# EAGLE design AUDIO_PR_2020 (EAGLE 7.3.0)

## Sheet 1 of 2
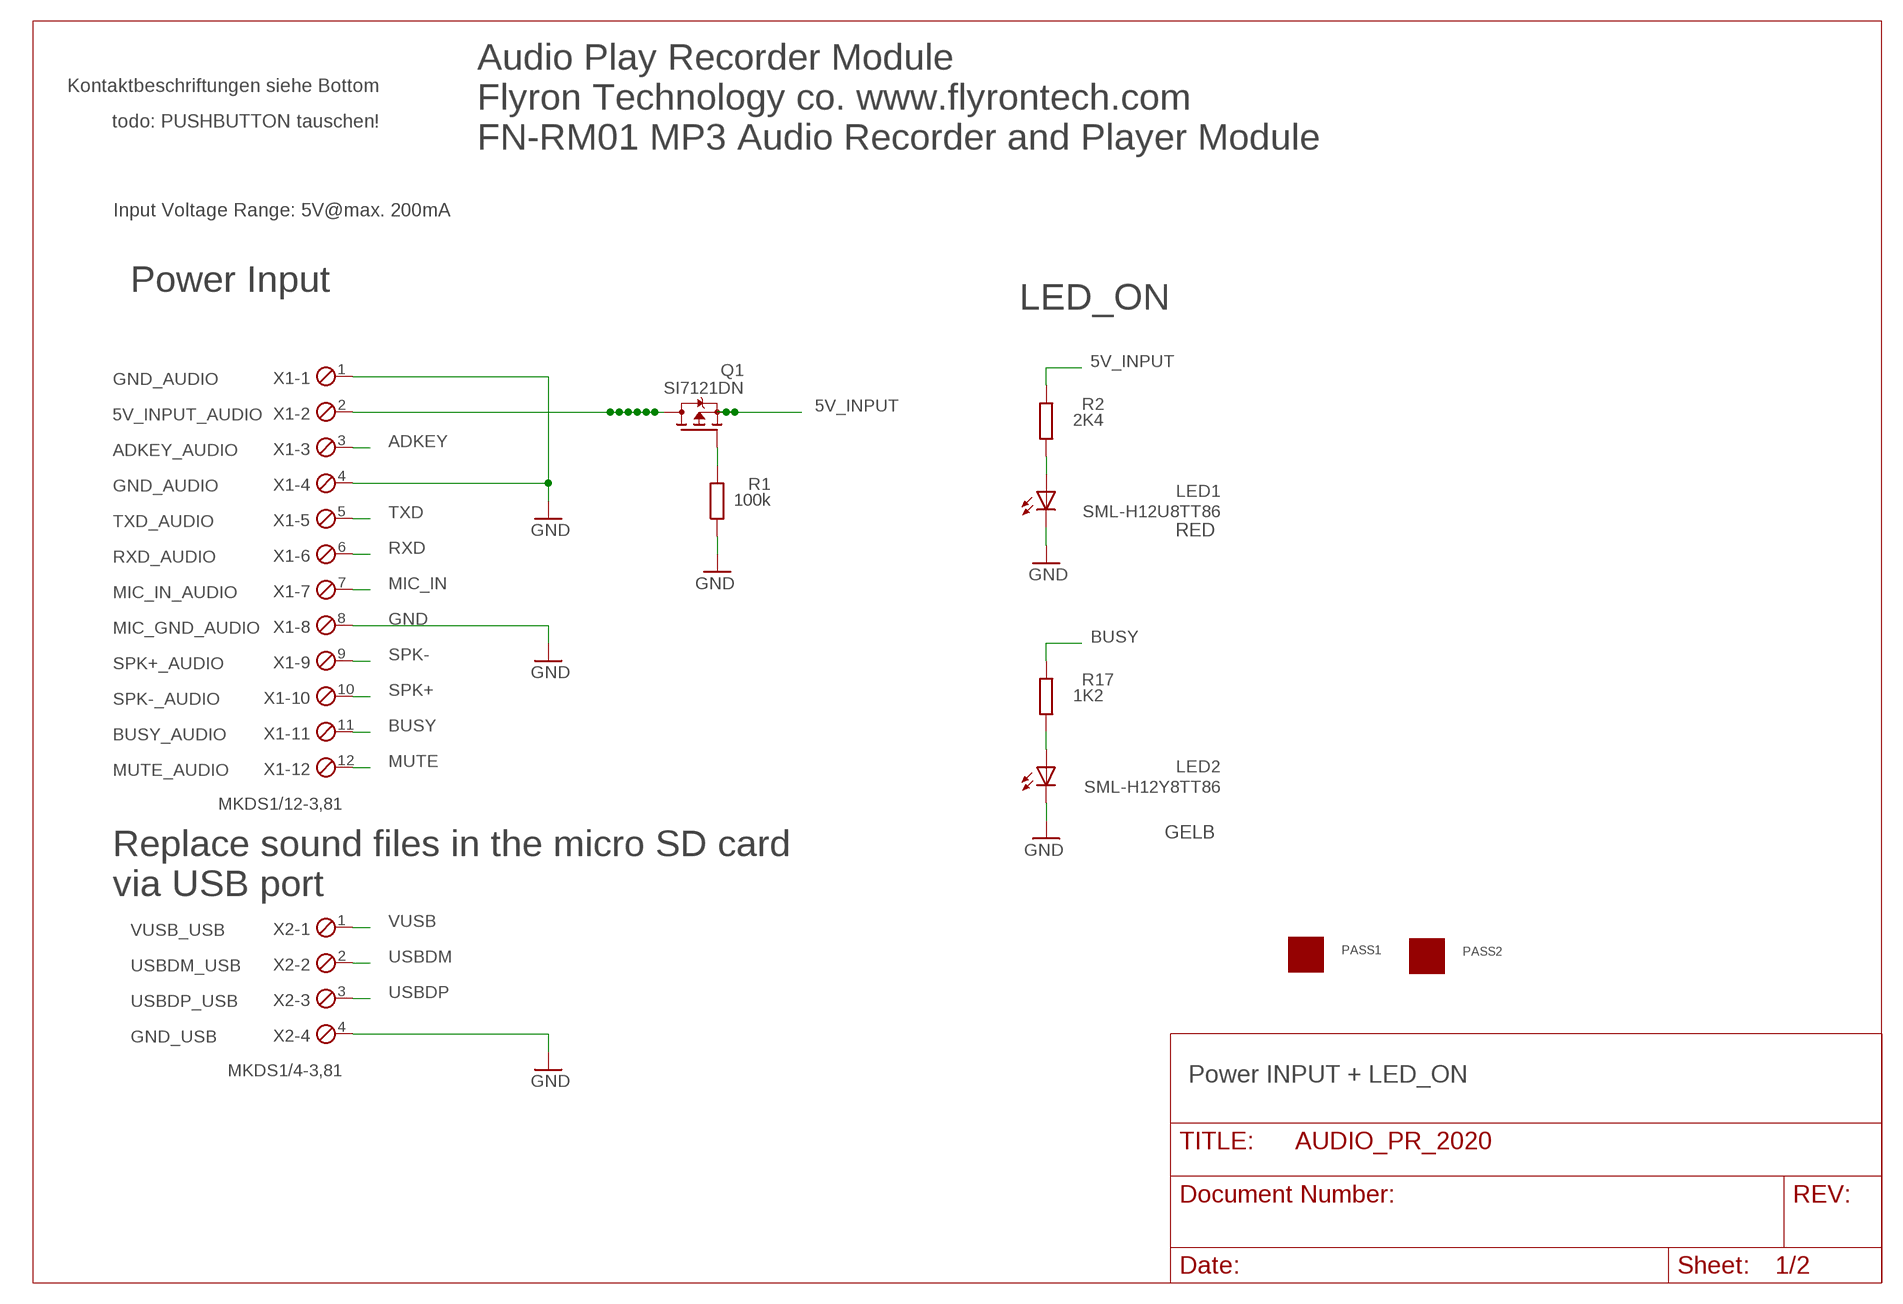
[diagram p0: schematic, sheet 1]

### Parts
LED1  SML-H12U8TT86  LEDCHIPLED_0805  [CHIPLED_0805]
LED2  SML-H12Y8TT86  LEDCHIPLED_0805  [CHIPLED_0805]
PASS1  ROUND_1MM1.5  [ROUND2_1.5MM]
PASS2  ROUND_1MM1.5  [ROUND2_1.5MM]
Q1  SI7121DN  TRANSISTOR-FET_SI7113DN  [TRANSISTOR-FET_1212-8S]
R1  100k  R-EU_R0805  [R0805]
R2  2K4  R-EU_R0805  [R0805]
R17  1K2  R-EU_R0805  [R0805]
X1  MKDS1/12-3,81  [12POL381]
X2  MKDS1/4-3,81  [4POL381]

### Nets
5V_INPUT: Q1.1(S) Q1.2(S) Q1.3(S) R2.1 ; also sheet 2
5V_INPUT_AUDIO: Q1.5(D) Q1.6(D) Q1.7(D) Q1.8(D) Q1.9(D) Q1.10(D) Q1.11(D) X1.2
ADKEY: X1.3 ; also sheet 2
BUSY: R17.1 X1.11 ; also sheet 2
GND: LED1.C LED2.C R1.1 X1.1 X1.4 X1.8 X2.4 ; also sheet 2
MIC_IN: X1.7 ; also sheet 2
MUTE: X1.12 ; also sheet 2
N$4: LED2.A R17.2
N$20: Q1.4(G) R1.2
N$29: LED1.A R2.2
RXD: X1.6 ; also sheet 2
SPK+: X1.10 ; also sheet 2
SPK-: X1.9 ; also sheet 2
TXD: X1.5 ; also sheet 2
USBDM: X2.2 ; also sheet 2
USBDP: X2.3 ; also sheet 2
VUSB: X2.1 ; also sheet 2

### Notes on the sheet
- Kontaktbeschriftungen siehe Bottom
- todo: PUSHBUTTON tauschen!
- Audio Play Recorder Module
  Flyron Technology co. www.flyrontech.com
  FN-RM01 MP3 Audio Recorder and Player Module
- Input Voltage Range: 5V@max. 200mA
- Power Input
- LED_ON
- GND_AUDIO
- 5V_INPUT_AUDIO
- ADKEY_AUDIO
- GND_AUDIO
- TXD_AUDIO
- RED
- RXD_AUDIO
- MIC_IN_AUDIO
- MIC_GND_AUDIO
- SPK+_AUDIO
- SPK-_AUDIO
- BUSY_AUDIO
- MUTE_AUDIO
- GELB
- Replace sound files in the micro SD card
  via USB port
- VUSB_USB
- USBDM_USB
- USBDP_USB
- GND_USB
- Power INPUT + LED_ON

## Sheet 2 of 2
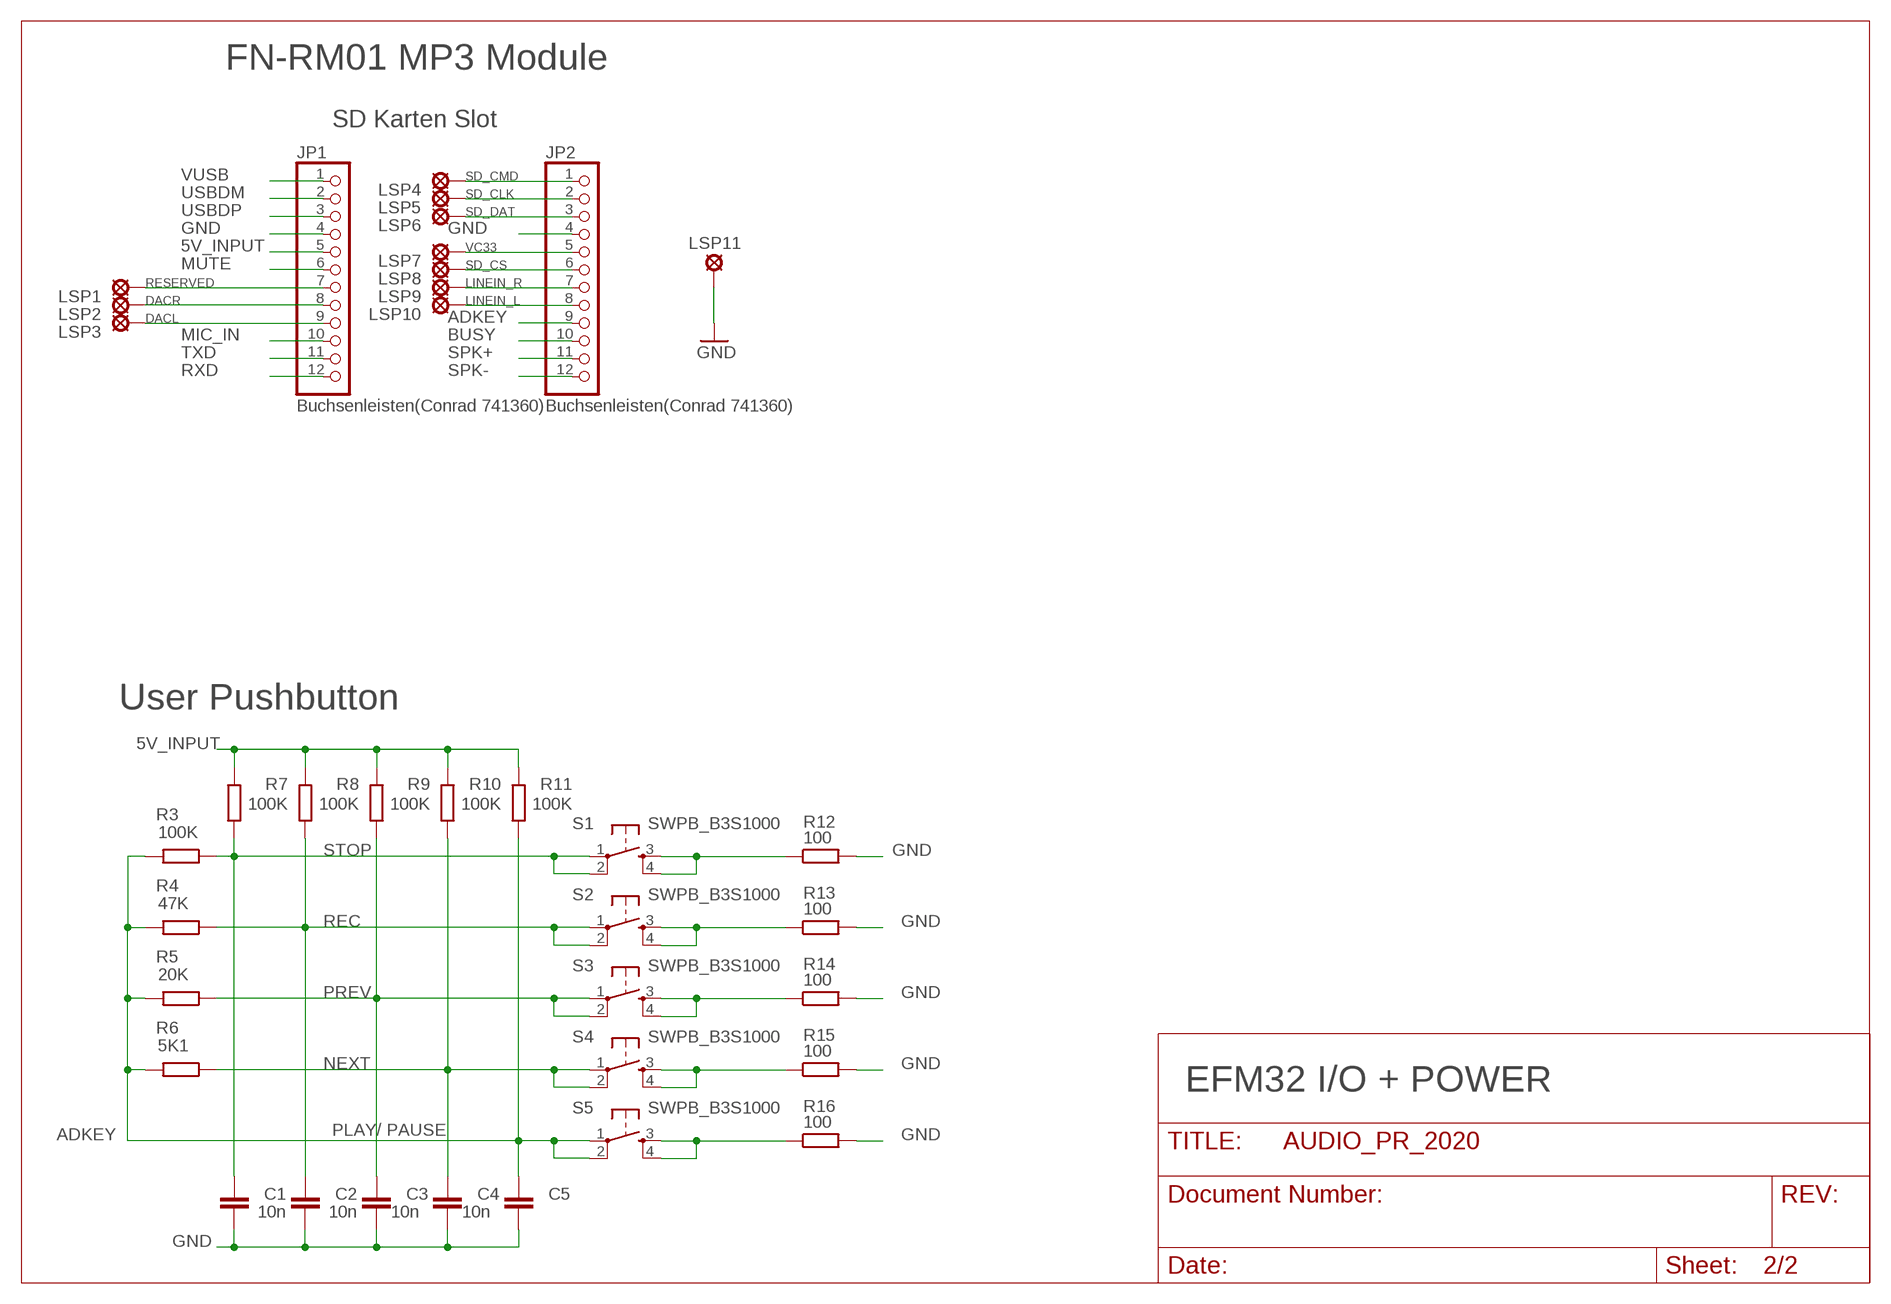
[diagram p1: schematic, sheet 2]

### Parts
C1  10n  C-EUC0603  [C0603]
C2  10n  C-EUC0603  [C0603]
C3  10n  C-EUC0603  [C0603]
C4  10n  C-EUC0603  [C0603]
C5  10n  C-EUC0603  [C0603]
JP1  Buchsenleisten(Conrad 741360)  PINHD-1X12  [1X12]
JP2  Buchsenleisten(Conrad 741360)  PINHD-1X12  [1X12]
LSP1  LSP10  [LSP10]
LSP2  LSP10  [LSP10]
LSP3  LSP10  [LSP10]
LSP4  LSP10  [LSP10]
LSP5  LSP10  [LSP10]
LSP6  LSP10  [LSP10]
LSP7  LSP10  [LSP10]
LSP8  LSP10  [LSP10]
LSP9  LSP10  [LSP10]
LSP10  LSP10  [LSP10]
LSP11  LSP10  [LSP10]
R3  100K  R-EU_R0805  [R0805]
R4  47K  R-EU_R0805  [R0805]
R5  20K  R-EU_R0805  [R0805]
R6  5K1  R-EU_R0805  [R0805]
R7  100K  R-EU_R0805  [R0805]
R8  100K  R-EU_R0805  [R0805]
R9  100K  R-EU_R0805  [R0805]
R10  100K  R-EU_R0805  [R0805]
R11  100K  R-EU_R0805  [R0805]
R12  100  R-EU_R0805  [R0805]
R13  100  R-EU_R0805  [R0805]
R14  100  R-EU_R0805  [R0805]
R15  100  R-EU_R0805  [R0805]
R16  100  R-EU_R0805  [R0805]
S1  SWPB_B3S1000  DTSM-6  [DTSM-6]
S2  SWPB_B3S1000  DTSM-6  [DTSM-6]
S3  SWPB_B3S1000  DTSM-6  [DTSM-6]
S4  SWPB_B3S1000  DTSM-6  [DTSM-6]
S5  SWPB_B3S1000  DTSM-6  [DTSM-6]

### Nets
5V_INPUT: JP1.5 R7.2 R8.2 R9.2 R10.2 R11.2 ; also sheet 1
ADKEY: C5.2 JP2.9 R3.2 R4.2 R5.2 R6.2 R11.1 S5.1 S5.2 ; also sheet 1
BUSY: JP2.10 ; also sheet 1
DACL: JP1.9 LSP3.MP
DACR: JP1.8 LSP2.MP
GND: C1.1 C2.1 C3.1 C4.1 C5.1 JP1.4 JP2.4 LSP11.MP R12.2 R13.2 R14.2 R15.2 R16.2 ; also sheet 1
LINEIN_L: JP2.8 LSP10.MP
LINEIN_R: JP2.7 LSP9.MP
MIC_IN: JP1.10 ; also sheet 1
MUTE: JP1.6 ; also sheet 1
N$2: R14.1 S3.3 S3.4
N$5: R15.1 S4.3 S4.4
N$6: R16.1 S5.3 S5.4
N$23: R12.1 S1.3 S1.4
N$24: R13.1 S2.3 S2.4
NEXT: C4.2 R6.1 R10.1 S4.1 S4.2
PREV: C3.2 R5.1 R9.1 S3.1 S3.2
REC: C2.2 R4.1 R8.1 S2.1 S2.2
RESERVED: JP1.7 LSP1.MP
RXD: JP1.12 ; also sheet 1
SD_CLK: JP2.2 LSP5.MP
SD_CMD: JP2.1 LSP4.MP
SD_CS: JP2.6 LSP8.MP
SD_DAT: JP2.3 LSP6.MP
SPK+: JP2.11 ; also sheet 1
SPK-: JP2.12 ; also sheet 1
STOP: C1.2 R3.1 R7.1 S1.1 S1.2
TXD: JP1.11 ; also sheet 1
USBDM: JP1.2 ; also sheet 1
USBDP: JP1.3 ; also sheet 1
VC33: JP2.5 LSP7.MP
VUSB: JP1.1 ; also sheet 1

### Notes on the sheet
- FN-RM01 MP3 Module
- SD Karten Slot
- User Pushbutton
- EFM32 I/O + POWER
- PLAY/ PAUSE

## Library data of the parts
C1-C5 = resistor:C-EU: CAPACITOR, European symbol
JP1 JP2 = pinhead:PINHD-1X12: PIN HEADER
LED1 LED2 = led:LED: LED OSRAM: - CHIPLED LG R971, LG N971, LY N971, LG Q971, LY Q971, LO R971, LY R971 LH N974, LH R974 LS Q976, LO Q976, LY Q976 LO Q996 - Hyper CHIPLED LW Q18S LB Q993, LB Q99A, LB R99A - SideLED LS A670, LO A670, LY A670, LG A670, LP A670 LB A673, LV A673, LT A673, LW A673 LH A674 LY A675 LS A676, LA A676, LO A676, LY A676, LW A676 LS A679, LY A679, LG A679 - Hyper Micro SIDELED® LS Y876, LA Y876, LO Y876, LY Y876 LT Y87S - SmartLED LW L88C, LW L88S LB L89C, LB L89S, LG L890 LS L89K, LO L89K, LY L89K LS L896, LA L896, LO L896, LY L896 - TOPLED LS T670, LO T670, LY T670, LG T670, LP T670 LSG T670, LSP T670, LSY T670, LOP T670, LYG T670 LG T671, LOG T671, LSG T671 LB T673, LV T673, LT T673, LW T673 LH T674 LS T676, LA T676, LO T676, LY T676, LB T676, LH T676, LSB T676, LW T676 LB T67C, LV T67C, LT T67C, LS T67K, LO T67K, LY T67K, LW E67C LS E67B, LA E67B, LO E67B, LY E67B, LB E67C, LV E67C, LT E67C LW T67C LS T679, LY T679, LG T679 LS T770, LO T770, LY T770, LG T770, LP T770 LB T773, LV T773, LT T773, LW T773 LH T774 LS E675, LA E675, LY E675, LS T675 LS T776, LA T776, LO T776, LY T776, LB T776 LHGB T686 LT T68C, LB T68C - Hyper Mini TOPLED® LB M676 - Mini TOPLED Santana® LG M470 LS M47K, LO M47K, LY M47K Source: http://www.osram.convergy.de LUXEON: - LUMILED® LXK2-PW12-R00, LXK2-PW12-S00, LXK2-PW14-U00, LXK2-PW14-V00 LXK2-PM12-R00, LXK2-PM12-S00, LXK2-PM14-U00 LXK2-PE12-Q00, LXK2-PE12-R00, LXK2-PE12-S00, LXK2-PE14-T00, LXK2-PE14-U00 LXK2-PB12-K00, LXK2-PB12-L00, LXK2-PB12-M00, LXK2-PB14-N00, LXK2-PB14-P00, LXK2-PB14-Q00 LXK2-PR12-L00, LXK2-PR12-M00, LXK2-PR14-Q00, LXK2-PR14-R00 LXK2-PD12-Q00, LXK2-PD12-R00, LXK2-PD12-S00 LXK2-PH12-R00, LXK2-PH12-S00 LXK2-PL12-P00, LXK2-PL12-Q00, LXK2-PL12-R00 Source: www.luxeon.com KINGBRIGHT: KA-3528ASYC Source: www.kingbright.com
LSP1-LSP11 = solpad:LSP10: SOLDER PAD drill 1.0 mm, distributor Buerklin, 12H555
PASS1 PASS2 = Passermarks:ROUND_1MM
Q1 = dcdc_BB3_V0:TRANSISTOR-FET_SI7113DN
R1-R17 = resistor:R-EU_: RESISTOR, European symbol
S1-S5 = switch-tact:DTSM-6
X1 = con-phoenix-381:MKDS1/12-3,81: MKDS 1/12-3,81 - Order No. 1727117 Pitch: 3,81mm Number of terminals: 12 Rated Voltage: 160V Maximum load current/ cross section: 12A/1.5mm2-AWG16 Housing Interlocking: none Color: Green
X2 = con-phoenix-381:MKDS1/4-3,81: MKDS 1/4-3,81 - Order No. 1727036 Pitch: 3,81mm Number of terminals: 4 Rated Voltage: 160V Maximum load current/ cross section: 12A/1.5mm2-AWG16 Housing Interlocking: none Color: Green

## Net classes
1 GND: width 0.2 mm
2 VCC: width 0.25 mm

## Board
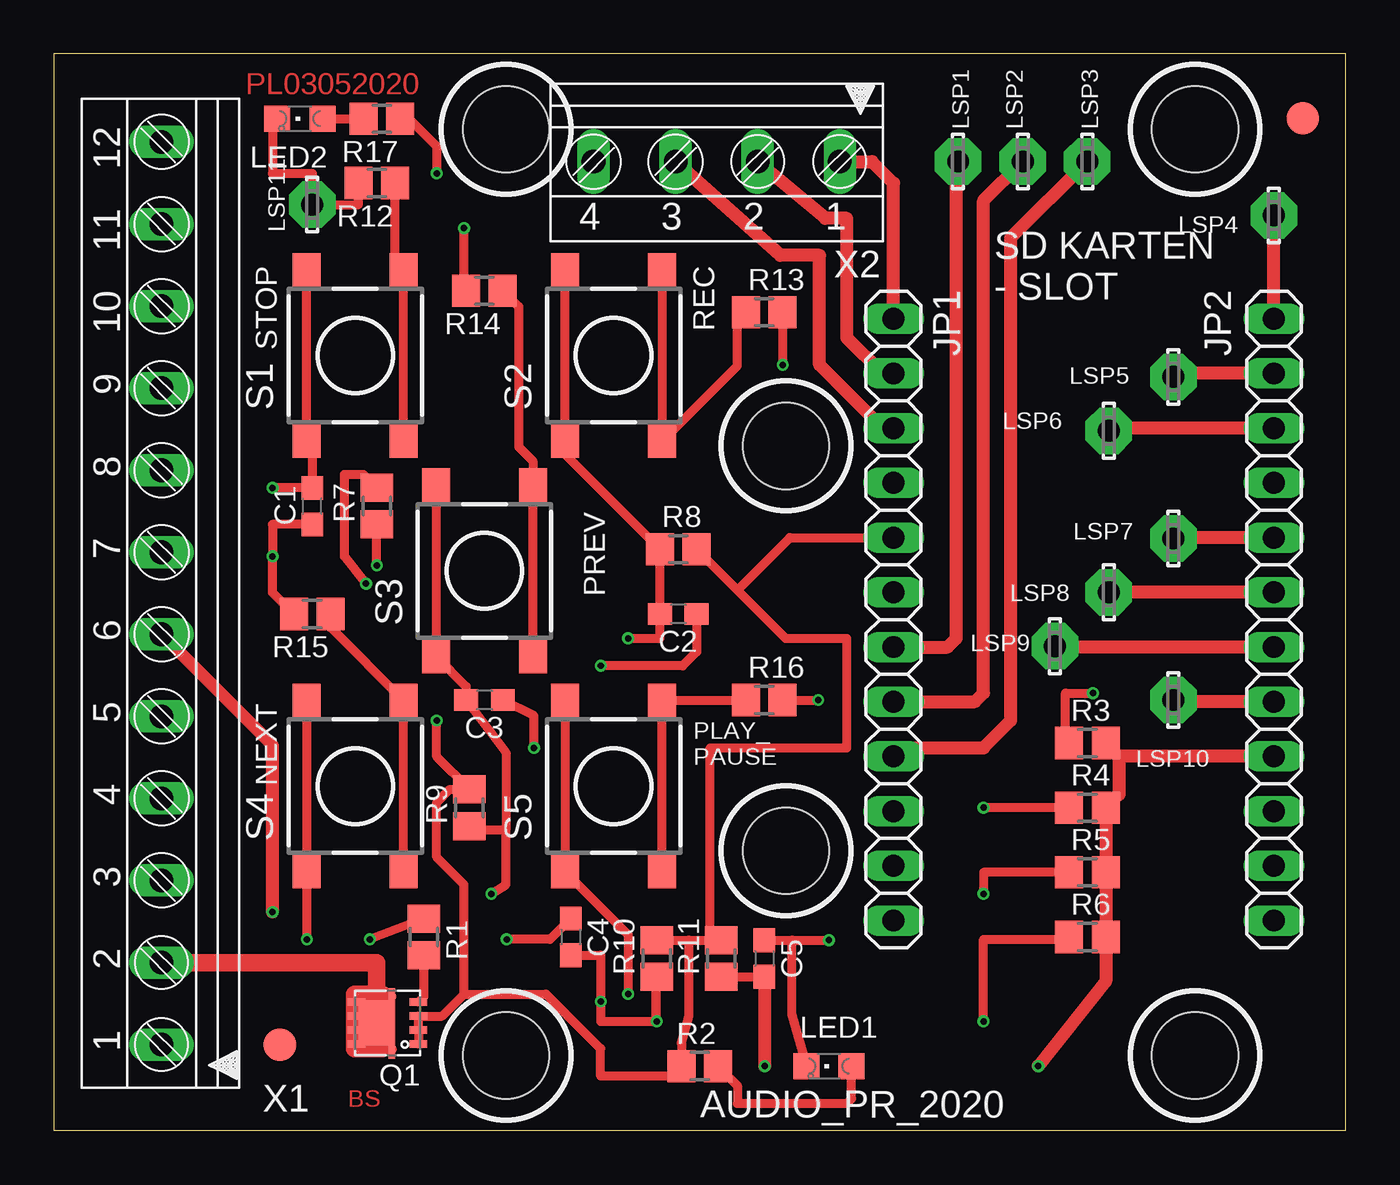
[diagram p2: board, top side]
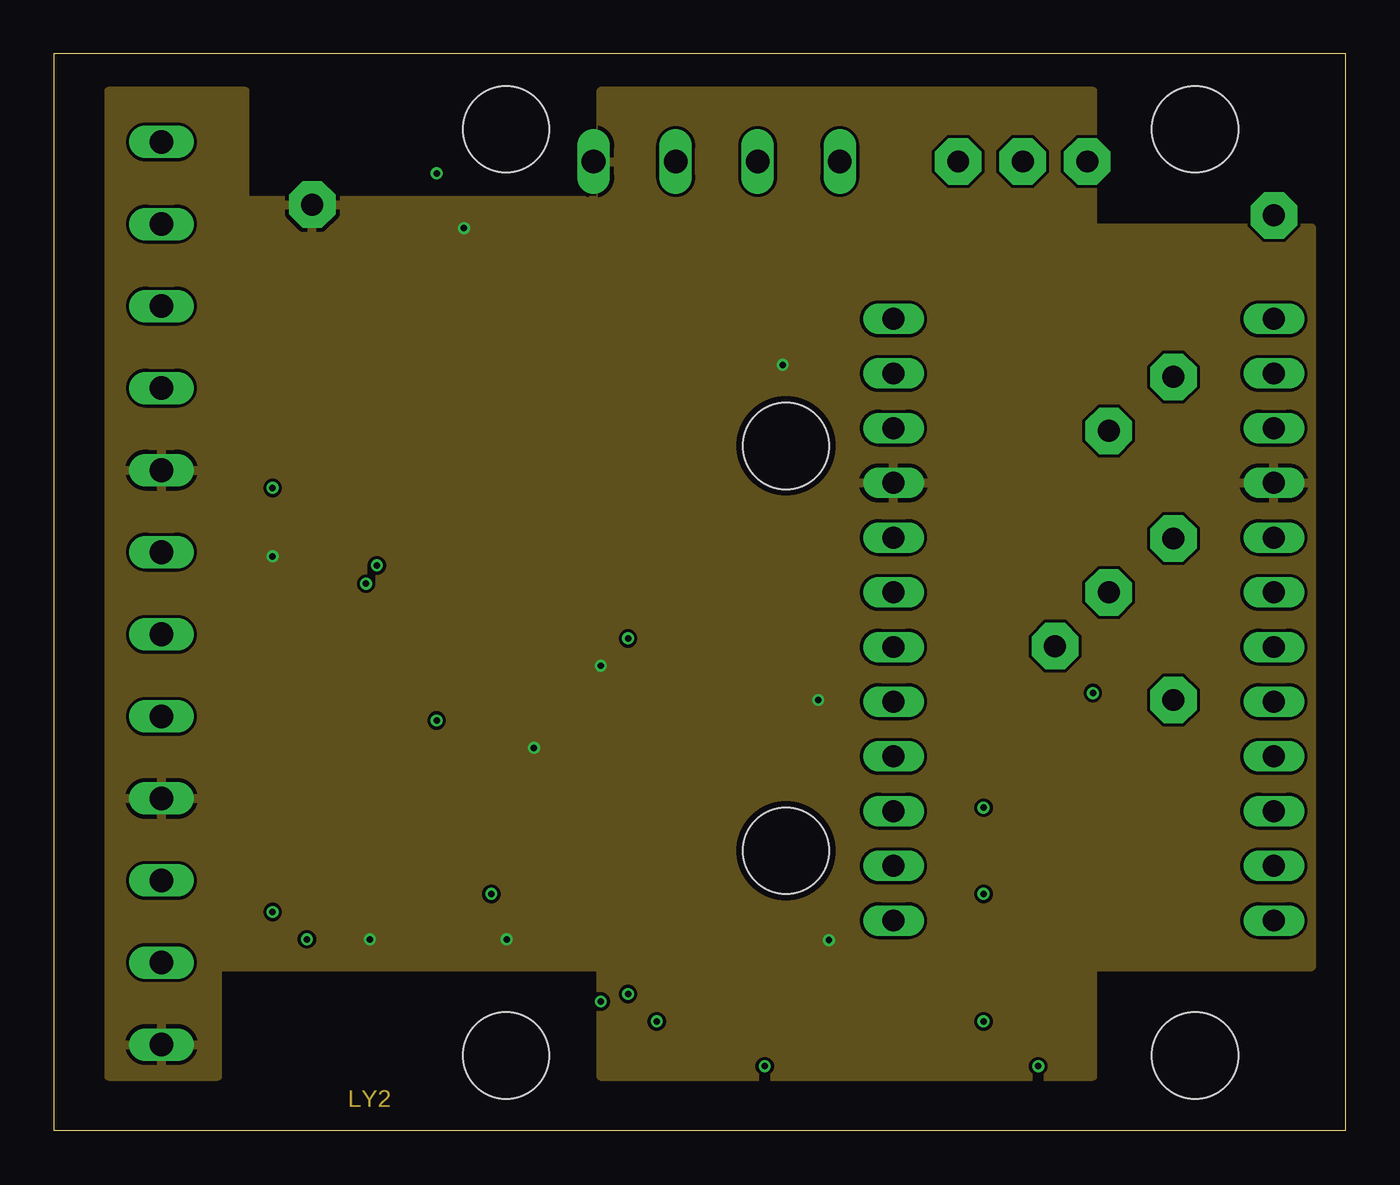
[diagram p3: board, inner layer Route2]
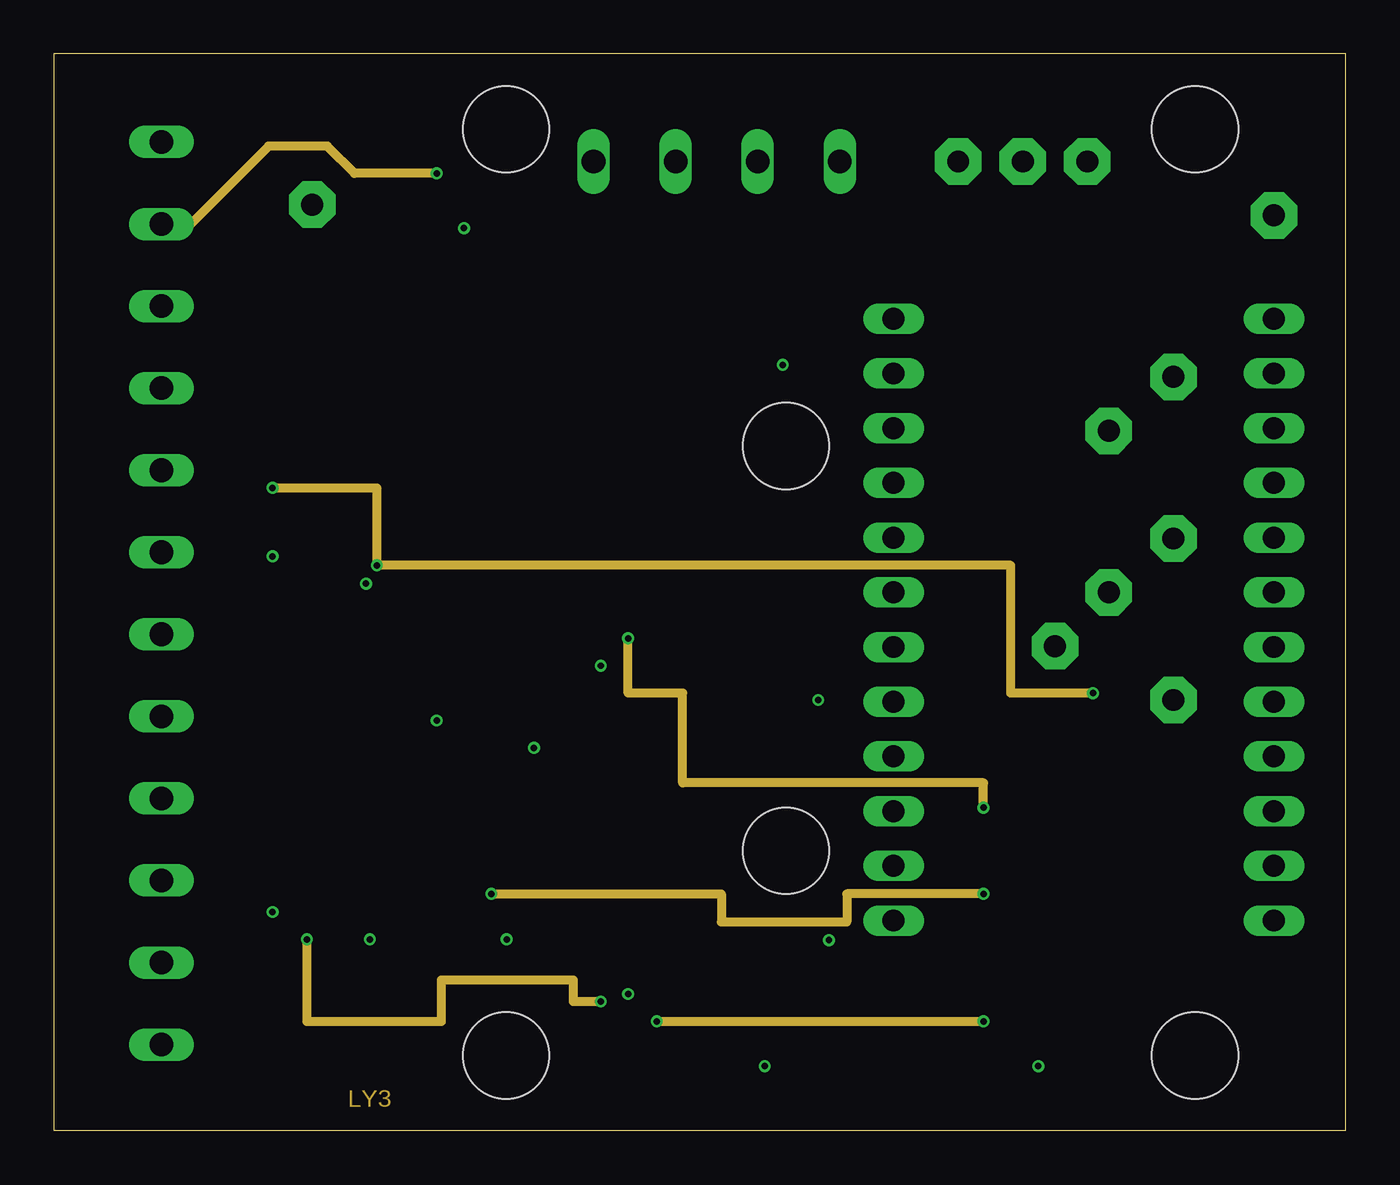
[diagram p4: board, inner layer Route3]
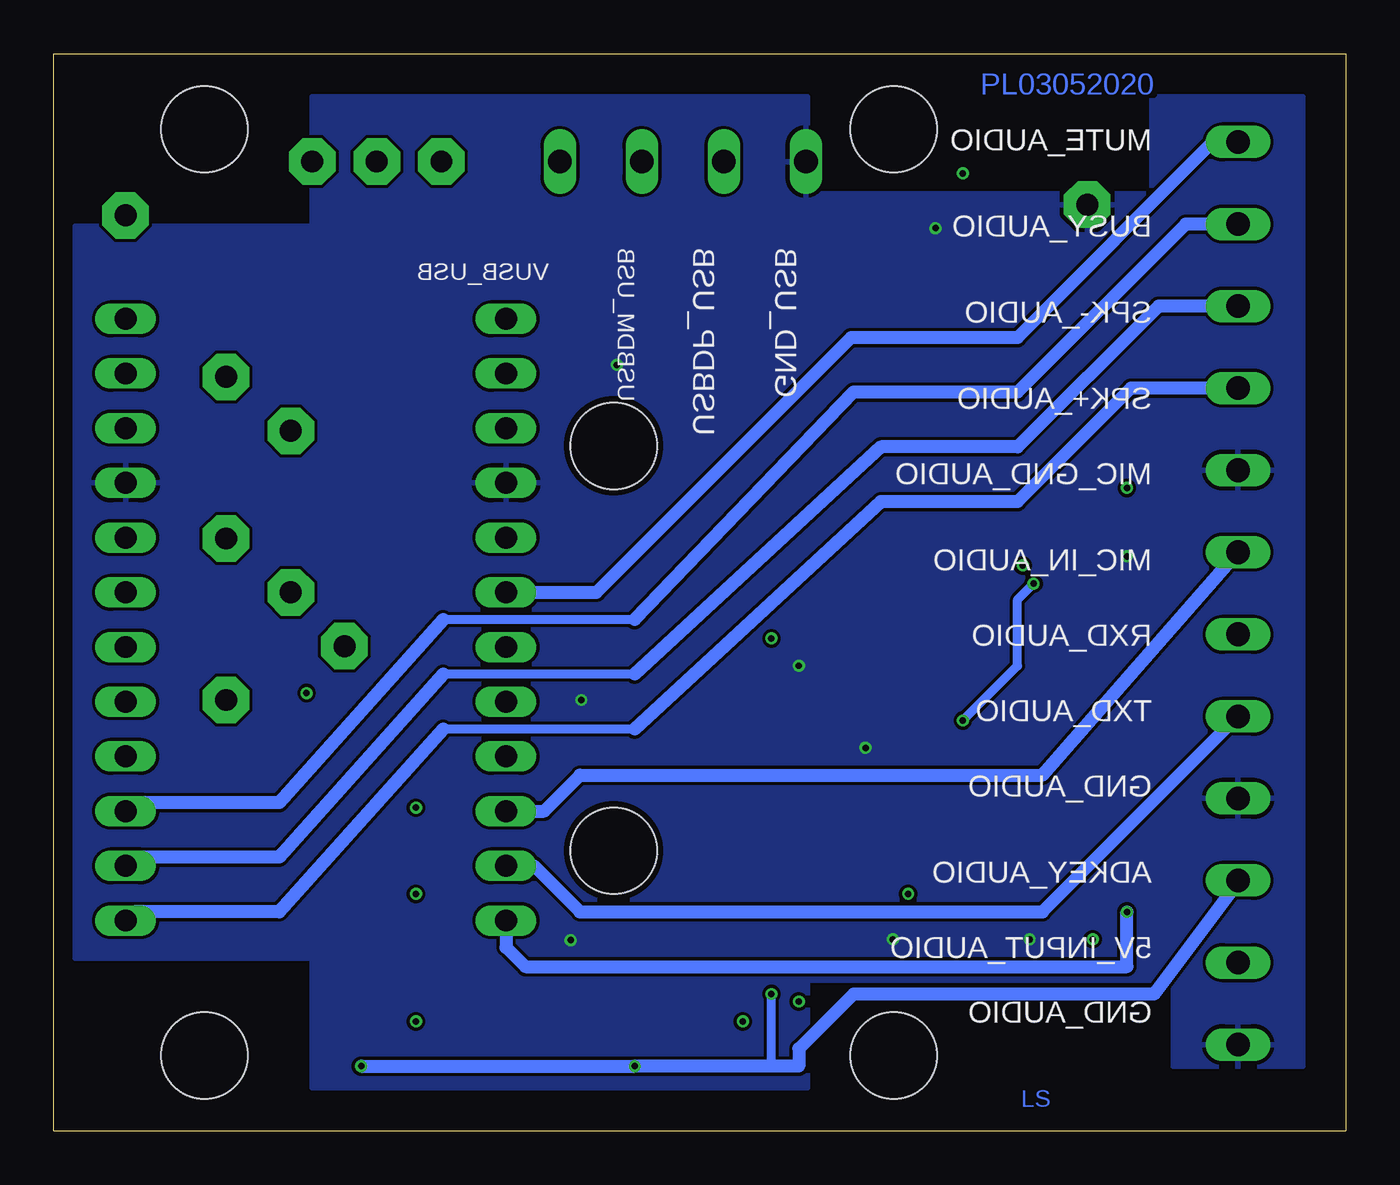
[diagram p5: board, bottom side, seen from below]

Size 60 x 50 mm. Coordinates in mm from the lower left corner, seen from the top.
Outline: 0,50 0,0 60,0 60,50 0,50
Copper layers (1+2*3+16): Top 0.035mm / dielectric 0.2mm / Route2 0.035mm / dielectric 1mm / Route3 0.035mm / dielectric 0.2mm / Bottom 0.035mm
Design rules "default *": minimum track width 0.125mm, minimum drill 0.2mm, track to track 0.15mm, track to pad 0.15mm, pad to pad 0.15mm, via to via 0.15mm, smd to smd 0mil, copper to edge 0.3mm, drill to drill 0.2mm, minimum pad ring 0.2mm, minimum via ring 0.125mm, stop-mask expansion 0.075mm, vias tented up to drill 0mil, thermal gap 0.2mm
Holes 4 mm at 21,46.5 53,3.5 21,3.5 53,46.5 34,13 34,31.8

### Footprints (pad centres in the part's own frame; a part is rotated, then mirrored left to right if it is on the bottom)
C0603 = smd 1.1 x 1: 1 -0.85,0; 2 0.85,0
1X12 = drill 1.016 long: 1 -13.97,0; 2 -11.43,0; 3 -8.89,0; 4 -6.35,0; 5 -3.81,0; 6 -1.27,0; 7 1.27,0; 8 3.81,0; 9 6.35,0; 10 8.89,0; 11 11.43,0; 12 13.97,0
CHIPLED_0805 = smd 1.2 x 1.2: A 0,-1.05; C 0,1.05
LSP10 = drill 1.016 pad 2.159 octagon: MP 0,0
ROUND2_1.5MM = smd 1.5 x 1.5: FID 0,0
TRANSISTOR-FET_1212-8S = smd 0.8 x 0.34: 1 -1.435,0.97; 2 -1.435,0.325; 3 -1.435,-0.325; 4 -1.435,-0.975; 5 1.435,-0.975; 6 1.435,-0.325; 7 1.435,0.325; 8 1.435,0.975 | smd 0.3 x 0.8: 9 -0.2,-1.225; 10 -0.2,1.25 | smd 1.7 x 2.1: 11 0.5,-0.015
R0805 = smd 1.3 x 1.5: 1 -0.85,0; 2 0.85,0
DTSM-6 = smd 1.55 x 1.3: 1 -3.975,2.25; 2 3.975,2.25; 3 -3.975,-2.25; 4 3.975,-2.25
12POL381 = drill 1.1 long: 1 0,0; 2 3.81,0; 3 7.62,0; 4 11.43,0; 5 15.24,0; 6 19.05,0; 7 22.86,0; 8 26.67,0; 9 30.48,0; 10 34.29,0; 11 38.1,0; 12 41.91,0
4POL381 = drill 1.1 long: 1 0,0; 2 3.81,0; 3 7.62,0; 4 11.43,0

### Placement (x,y rotation side)
C1  12,29 90 top
C2  29,24 180 top
C3  20,20 180 top
C4  24,9 270 top
C5  33,8 270 top
JP1  39,23.73 270 top
JP2  56.67,23.73 270 top
LED1  36,3 90 top
LED2  11.43,46.99 90 top
LSP1  42,45 90 top
LSP2  45,45 90 top
LSP3  48,45 90 top
LSP4  56.67,42.5 90 top
LSP5  52,35 90 top
LSP6  49,32.5 90 top
LSP7  52,27.5 90 top
LSP8  49,25 90 top
LSP9  46.5,22.5 90 top
LSP10  52,20 90 top
LSP11  12,43 90 top
PASS1  10.5,4 0 top
PASS2  58,47 0 top
Q1  15.5,5 180 top
R1  17.19,9 270 top
R2  30,3 0 top
R3  48,18 0 top
R4  48,15 0 top
R5  48,12 0 top
R6  48,9 0 top
R7  15,29 90 top
R8  29,27 0 top
R9  19.3,15 90 top
R10  28,8 90 top
R11  31,8 90 top
R12  15,44 180 top
R13  33,38 0 top
R14  20,39 180 top
R15  12,24 180 top
R16  33,20 0 top
R17  15.24,46.99 180 top
S1  14,36 90 top
S2  26,36 90 top
S3  20,26 90 top
S4  14,16 90 top
S5  26,16 90 top
X1  5,4 90 top
X2  36.5,45 180 top

### Tracks (layer width: path | path; a pad name or v marks a point on that pad's centre or on a via)
5V_INPUT  (via drill 0.3)
  Top 0.406: Q1.1 Q1.2 Q1.3 18.02,5.33 19.05,6.35 | 29.5,8.85 29.5,5.33 29.15,4.05 R2.1 29.07,2.54 25.4,2.54 25.4,3.81 22.86,6.35 19.05,6.35 | R10.2 29.5,8.85 | 29.5,8.85 R11.2 30.48,9.37 30.48,17.78 36.83,17.78 36.83,22.86 33.99,22.86 31.75,25.1 | 19.05,6.35 19.05,11.43 17.78,12.7 17.78,15.24 18.39,15.85 R9.2 17.78,17.37 v17.78,19.05 | R7.2 14.37,30.48 13.5,30.48 13.5,26.67 v14.5,25.4 | R8.2 31.75,25.1 | 31.75,25.1 34.19,27.54 JP1.5
  Bottom 0.406: v17.78,19.05 15.24,21.59 15.24,24.66 v14.5,25.4
5V_INPUT_AUDIO
  Top 0.406: Q1.9 15,6.22 | 15.24,3.81 15.7,3.81 Q1.10
  Top 0.813: X1.2 15,7.81 Q1.11 | Q1.5 Q1.6 | Q1.6 Q1.7 | Q1.7 Q1.8 | Q1.6 15,5.33 Q1.11 | Q1.11 15.24,5.01 15.24,6.35 14.06,6.35 | 13.97,5.08 15.24,5.08 15.24,3.81 13.97,3.81 13.97,4.67 | 14.06,6.35 13.97,6.35 13.97,5.08 | 14.06,6.35 Q1.7 | Q1.7 13.97,4.67 | 13.97,4.67 13.97,5.08 | 15,6.22 Q1.11
ADKEY  (via drill 0.3)
  Top 0.406: S5.2 S5.1 26.67,9.11 v26.67,6.35 | R11.1 C5.2
  Top 0.61: JP2.9 49.47,17.38 | 49.47,17.38 R3.2 | 49.47,17.38 49.47,15.62 R4.2 R5.2 R6.2 48.85,6.94 v45.72,3 | v33.02,3 33.02,7.13 C5.2
  Bottom 0.406: 25.4,3 26.67,3 v26.67,6.35
  Bottom 0.61: v45.72,3 v33.02,3 25.4,3 25.4,3.81 22.86,6.35 8.89,6.35 5,11.51 X1.3
BUSY  (via drill 0.3)
  Top 0.406: R17.1 16.51,46.99 17.78,45.72 v17.78,44.45
  Route3 0.406: v17.78,44.45 13.97,44.45 12.7,45.72 9.97,45.72 6.35,42.1 X1.11
  Bottom 0.406: 33.02,23.73 41.91,23.73
  Bottom 0.61: X1.11 7.43,42.1 15.24,34.29 22.86,34.29 33.02,23.73 | 41.91,23.73 49.53,15.24 56.27,15.24 JP2.10
DACL
  Top 0.61: JP1.9 39,17.41 39.37,17.78 43.18,17.78 44.45,19.05 44.45,41.45 LSP3.MP
DACR
  Top 0.61: JP1.8 42.78,19.92 43.18,20.32 43.18,43.18 LSP2.MP
GND  (via drill 0.3)
  Top 0.406: R15.2 10.16,24.99 v10.16,26.67 10.16,28.15 C1.1 | R12.2 14.15,43 LSP11.MP 12,44.45 10.16,44.45 10.16,46.99 LED2.C | R14.2 19.05,39 v19.05,41.91 | R13.2 v33.85,35.56 33.85,35.5 | v22.3,17.78 22.3,19.26 C3.1 | C5.1 34.29,8.85 | 34.29,8.85 v36,8.85 | LED1.C 34.29,5.34 34.29,8.85 | R16.2 v35.5,20 | C2.1 29.85,22.23 29.21,21.59 v25.4,21.59 | R1.1 v14.68,8.89 | C4.1 23.04,8.89 v21.03,8.89
  pour Bottom: 2,48 9,48 9,43.5 25,43.5 25,48 48,48 48,42 59,42 59,8 48,8 48,2 25,2 25,7 8,7 8,3 2,3
  pour Route2: 2.54,48.26 2.54,2.54 7.62,2.54 7.62,7.62 25.4,7.62 25.4,2.54 48.26,2.54 48.26,7.62 58.42,7.62 58.42,41.91 48.26,41.91 48.26,48.26 25.4,48.26 25.4,43.18 8.89,43.18 8.89,48.26
LINEIN_L
  Top 0.61: JP2.8 52.08,19.92 LSP10.MP
LINEIN_R
  Top 0.61: JP2.7 47.54,22.46 LSP9.MP
MIC_IN
  Bottom 0.61: JP1.10 37.23,14.84 35.56,16.51 14.08,16.51 X1.7
MUTE
  Bottom 0.61: JP1.6 34.8,25 22.97,36.83 15.24,36.83 6.16,45.91 X1.12
N$2
  Top 0.406: R14.1 21.59,38.26 21.59,31.75 22.25,31.09 S3.4 S3.3
N$4
  Top 0.406: LED2.A R17.2
N$5
  Top 0.406: S4.3 S4.4 12.85,23.38 R15.1
N$6
  Top 0.406: S5.3 S5.4 32.12,19.98 R16.1
N$20
  Top 0.406: Q1.4 17.19,6.23 R1.2
N$23
  Top 0.406: S1.3 S1.4 15.85,40.38 R12.1
N$24
  Top 0.406: S2.4 S2.3 31.75,35.52 31.75,38.1 31.85,38 R13.1
N$29
  Top 0.406: R2.2 31.75,2.1 31.75,1.27 36.83,1.27 37.05,1.49 LED1.A
NEXT  (via drill 0.3)
  Top 0.406: S4.2 S4.1 v11.75,8.89 | 27.94,5.08 25.4,5.08 v25.4,6 25.4,8.15 C4.2 | 27.94,5.08 v28,5.08 R10.1 27.94,7.15 27.94,5.08 | v43.18,5.08 43.18,8.89 47.15,8.89 R6.1
  Route3 0.406: v11.75,8.89 11.75,5.08 18,5.08 18,7 24.13,7 24.13,6 v25.4,6 | v28,5.08 v43.18,5.08
PREV  (via drill 0.3)
  Top 0.406: S3.2 S3.1 19.15,20.62 C3.2 21,17.56 21,13.97 | R9.1 19.3,13.72 19.55,13.97 21,13.97 | R5.1 43.18,12 v43.18,11 | v20.32,11 21,11.43 21,13.97
  Route3 0.406: v20.32,11 31,11 31,9.7 36.83,9.7 36.83,11 v43.18,11
REC  (via drill 0.3)
  Top 0.406: S2.2 S2.1 23.75,31.4 R8.1 C2.2 28.15,22.86 v26.67,22.86 | R4.1 v43.18,15
  Route3 0.406: v43.18,15 43.18,16.15 29.21,16.15 29.21,20.32 26.67,20.32 v26.67,22.86
RESERVED
  Top 0.61: JP1.7 41.51,22.46 41.91,22.86 41.91,44.91 LSP1.MP
RXD  (via drill 0.3)
  Top 0.61: v10.16,10.16 10.16,17.89 X1.6
  Bottom 0.61: JP1.12 39,8.52 38.1,7.62 10.16,7.62 v10.16,10.16
SD_CLK
  Top 0.61: JP2.2 52.16,35.16 LSP5.MP
SD_CMD
  Top 0.61: JP2.1 LSP4.MP
SD_CS
  Top 0.61: JP2.6 LSP8.MP
SD_DAT
  Top 0.61: JP2.3 49.12,32.62 LSP6.MP
SPK+
  Bottom 0.406: 33.02,21.2 41.91,21.2
  Bottom 0.61: X1.10 8.7,38.29 15.24,31.75 21.59,31.75 33.02,21.2 | 41.91,21.2 49.53,12.7 56.27,12.7 JP2.11
SPK-
  Bottom 0.406: 33.02,18.65 41.91,18.65
  Bottom 0.61: X1.9 9.97,34.48 15.24,29.21 21.59,29.21 33.02,18.65 | 41.91,18.65 49.53,10.16 56.27,10.16 JP2.12
STOP  (via drill 0.3)
  Top 0.406: S1.2 S1.1 12,32.02 C1.2 v10.16,29.85 | R3.1 46.99,18 | 46.99,18 46.99,17.78 | 46.99,18 46.99,20.32 v48.26,20.32 | v15,26.25 R7.1
  Route3 0.406: v48.26,20.32 44.45,20.32 44.45,26.25 v15,26.25 15,29.85 v10.16,29.85
TXD
  Bottom 0.61: JP1.11 37.7,12.3 35.56,10.16 14.08,10.16 X1.5
USBDM
  Top 0.61: JP1.2 38.5,35.16 36.83,36.83 36.83,42.36 35.83,42.36 X2.2
USBDP
  Top 0.61: JP1.3 38.5,32.62 35.56,35.56 35.56,40.64 33.74,40.64 X2.3
VC33
  Top 0.61: JP2.5 52.04,27.54 LSP7.MP
VUSB
  Top 0.61: JP1.1 39,44 38,45 X2.1

### Text on the board
Top: PL03052020 | BS
Route2: LY2
Route3: LY3
Bottom: PL03052020 | LS
tPlace: AUDIO_PR_2020
tNames: STOP | REC | SD KARTEN / - SLOT | PREV | NEXT | PLAY_ / PAUSE
bNames: MUTE_AUDIO | BUSY_AUDIO | GND_USB | USBDP_USB | USBDM_USB | VUSB_USB | SPK-_AUDIO | SPK+_AUDIO | MIC_GND_AUDIO | MIC_IN_AUDIO | RXD_AUDIO | TXD_AUDIO | GND_AUDIO | ADKEY_AUDIO | 5V_INPUT_AUDIO | GND_AUDIO